# EasyEDA schematic SCH_Juzer_pedal_sch_2024-03-11.json
TITLE: Sheet_1; REV: 1.0; Date: 2023-09-30; Sheet: 1/1; Drawn By: juzer666; Company: Your Company
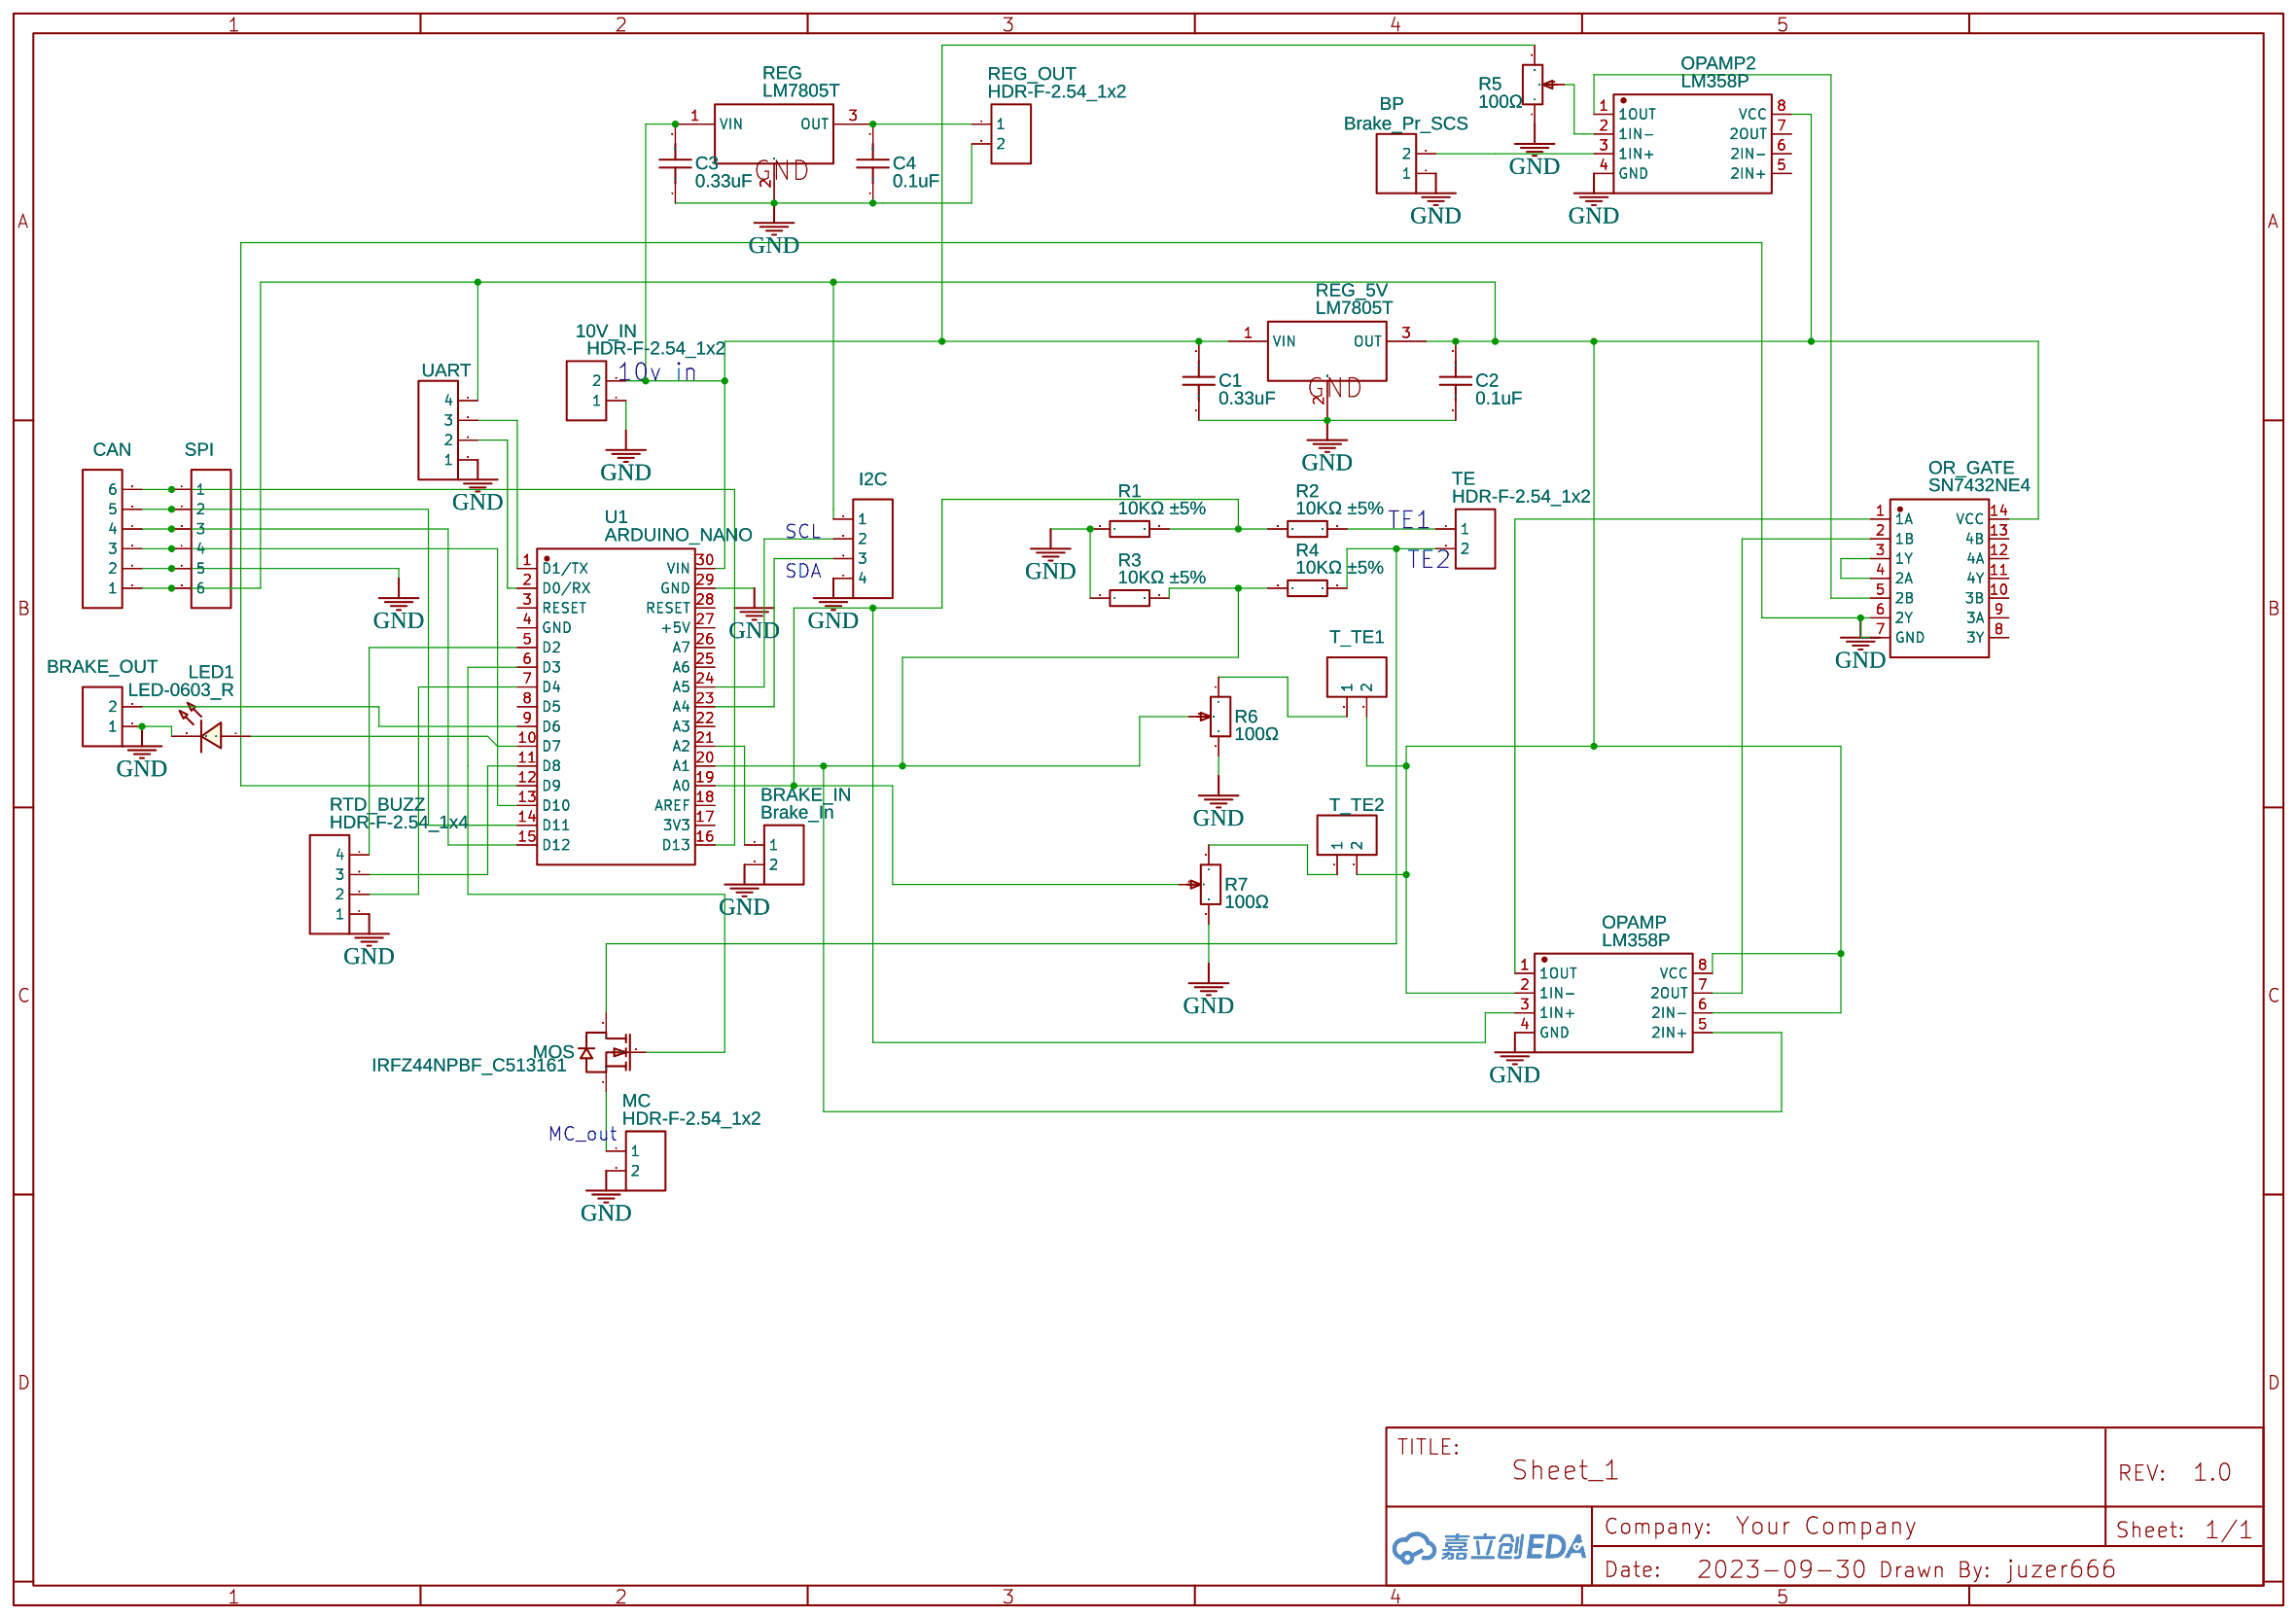
[diagram p0: schematic sheet]

## Parts
10V_IN  HDR-F-2.54_1x2  [CONN-TH_P5.00_KF126R-5.0-2P]
BP  Brake_Pr_SCS  [HDR-F-2.54_1X2]
BRAKE_IN  Brake_In  [CONN-TH_P5.00_KF126R-5.0-2P]
BRAKE_OUT  Brake_Out  [HDR-F-2.54_1X2]
C1  0.33uF  [C0603]
C2  0.1uF  [C0603]
C3  0.33uF  [C0603]
C4  0.1uF  [C0603]
CAN  CAN  [HDR-F-2.54_1X6]
I2C  I2C  [HDR-F-2.54_1X4]
LED1  LED-0603_R  [LED0603_RED]
MC  HDR-F-2.54_1x2  [CONN-TH_P5.00_KF126R-5.0-2P]
MOS  IRFZ44NPBF_C513161  [TO-220-3_L10.0-W4.5-P2.54-L]
OPAMP  LM358P  [DIP-8_L9.4-W6.4-P2.54-LS9.1-BL]
OPAMP2  LM358P  [DIP-8_L9.4-W6.4-P2.54-LS9.1-BL]
OR_GATE  SN7432NE4  [PDIP-14_L19.3-W6.4-P2.54-LS7.9-BL-1]
R1  10KΩ ±5%  [RESISTANCE 10K]
R2  10KΩ ±5%  [RESISTANCE 10K]
R3  10KΩ ±5%  [RESISTANCE 10K]
R4  10KΩ ±5%  [RESISTANCE 10K]
R5  100Ω  [RES-ADJ-TH_3296W]
R6  100Ω  [RES-ADJ-TH_3296W]
R7  100Ω  [RES-ADJ-TH_3296W]
REG  LM7805T  [TO-220-3_L10.0-W4.5-P2.54-L]
REG_5V  LM7805T  [TO-220-3_L10.0-W4.5-P2.54-L]
REG_OUT  HDR-F-2.54_1x2  [HDR-F-2.54_1X2]
RTD_BUZZ  HDR-F-2.54_1x4  [HDR-F-2.54_1X4]
SPI  SPI  [HDR-F-2.54_1X6]
T_TE1  TE1_Test  [HDR-F-2.54_1X2]
T_TE2  TE2_Test  [HDR-F-2.54_1X2]
TE  HDR-F-2.54_1x2  [CONN-TH_P5.00_KF126R-5.0-2P]
U1  ARDUINO_NANO  [COMM-TH_ARDUINO_NANO]
UART  UART  [HDR-F-2.54_1X4]

## Library data of the parts
10V_IN BP BRAKE_IN BRAKE_OUT MC REG_OUT T_TE1 T_TE2 TE = HDR-F-2.54_1x2: Supplier Part: C49661; Supplier: LCSC; Contributor: LCEDA_Lib
C1-C4 = 250V 0.1UF 5% CBBCapacitor: Supplier: LCSC; Manufacturer: ReliaPro; Supplier Part: C46804
CAN SPI = HDR-F-2.54_1x6: Supplier Part: C40877; Supplier: LCSC; Contributor: LCEDA_Lib
I2C RTD_BUZZ UART = HDR-F-2.54_1x4: Supplier Part: C225501; Supplier: LCSC; Contributor: LCEDA_Lib
LED1 = LED-0603_R: Manufacturer: EVERLIGHT(台湾亿光); Manufacturer Part: 19-217/R6C-AL1M2VY/3T; Supplier Part: C72044; Supplier: LCSC; Contributor: LCEDA_01
MOS = IRFZ44NPBF_C513161: Supplier: LCSC; Supplier Part: C513161; Manufacturer: null; Manufacturer Part: IRFZ44NPBF; Contributor: LCSC
OPAMP OPAMP2 = LM358P: Supplier: LCSC; Manufacturer: TI(德州仪器); Supplier Part: C5213; JLCPCB Part Class: Extended Part
OR_GATE = SN7432NE4: Contributor: lcsc; Supplier: LCSC; Supplier Part: C4471426; Manufacturer: TI(德州仪器)
R1-R4 = RESISTANCE_10K: Supplier: LCSC; Supplier Part: C123392; Manufacturer: Nanjing Shiheng Elec; Manufacturer Part: MF58 103J3470; Contributor: Evgeniy_ANP; JLCPCB Part Class: Extended Part
R5-R7 = 3296W-1-101LF: Supplier: LCSC; Manufacturer: BOURNS; Supplier Part: C83688; Resistance(Ohms): 100; Resistance (Ohms): 100; JLCPCB Part Class: Extended Part
REG REG_5V = LM7805T: Contributor: LCSC; Supplier: LCSC; Supplier Part: C507145; Manufacturer: HGC(华冠); JLCPCB Part Class: Extended Part
U1 = ARDUINO_NANO: Supplier: LCSC; Supplier Part: C9900017879; Manufacturer: null; JLCPCB Part Class: Extended Part; Contributor: lcsc

## Nets
GND: 10V_IN.1 BP.1 BRAKE_IN.2 BRAKE_OUT.1 C1.1 C2.1 C3.1 C4.1 CAN.2 I2C.4 LED1.2 MC.2 OPAMP.4(GND) OPAMP2.4(GND) OR_GATE.6(2Y) OR_GATE.7(GND) R1.1 R3.1 R5.1 R6.3 R7.3 REG.2(GND) REG_5V.2(GND) REG_OUT.2 RTD_BUZZ.1 SPI.5 U1.12(D9) U1.29(GND) UART.1
Net-(10V_IN-2): 10V_IN.2 C1.2 C3.2 R5.3 REG.1(VIN) REG_5V.1(VIN) U1.30(VIN)
Net-(BP-2): BP.2 OPAMP2.3(1IN+)
Net-(BRAKE_IN-1): BRAKE_IN.1 U1.21(A2)
Net-(BRAKE_OUT-2): BRAKE_OUT.2 U1.9(D6)
Net-(C2-2): C2.2 CAN.1 I2C.1 OPAMP.2(1IN-) OPAMP.6(2IN-) OPAMP.8(VCC) OPAMP2.8(VCC) OR_GATE.14(VCC) REG_5V.3(OUT) SPI.6 T_TE1.2 T_TE2.2 UART.4
Net-(C4-2): C4.2 REG.3(OUT) REG_OUT.1
Net-(CAN-3): CAN.3 SPI.4 U1.13(D10)
Net-(CAN-4): CAN.4 SPI.3 U1.15(D12)
Net-(CAN-5): CAN.5 SPI.2 U1.14(D11)
Net-(CAN-6): CAN.6 SPI.1 U1.16(D13)
Net-(I2C-2): I2C.2 U1.24(A5)
Net-(I2C-3): I2C.3 U1.23(A4)
Net-(LED1-1): LED1.1 U1.10(D7)
Net-(MC-1): MC.1 MOS.3(S)
Net-(MOS-1): MOS.1(G) U1.6(D3)
Net-(MOS-2): MOS.2(D) R4.2 TE.2
Net-(OPAMP2-1): OPAMP2.1(1OUT) OR_GATE.5(2B)
Net-(OPAMP2-2): OPAMP2.2(1IN-) R5.2
Net-(OPAMP-1): OPAMP.1(1OUT) OR_GATE.1(1A)
Net-(OPAMP-3): OPAMP.3(1IN+) R1.2 R2.1 R7.2 U1.19(A0)
Net-(OPAMP-5): OPAMP.5(2IN+) R3.2 R4.1 R6.2 U1.20(A1)
Net-(OPAMP-7): OPAMP.7(2OUT) OR_GATE.2(1B)
Net-(OR_GATE-3): OR_GATE.3(1Y) OR_GATE.4(2A)
Net-(R2-2): R2.2 TE.1
Net-(R6-1): R6.1 T_TE1.1
Net-(R7-1): R7.1 T_TE2.1
Net-(RTD_BUZZ-2): RTD_BUZZ.2 U1.7(D4)
Net-(RTD_BUZZ-3): RTD_BUZZ.3 U1.11(D8)
Net-(RTD_BUZZ-4): RTD_BUZZ.4 U1.5(D2)
Net-(U1-1): U1.1(D1/TX) UART.3
Net-(U1-2): U1.2(D0/RX) UART.2

Not connected (* = marked no-connect by the designer): OPAMP2 5(2IN+) 6(2IN-) 7(2OUT); OR_GATE 8(3Y) 9(3A) 10(3B) 11(4Y) 12(4A) 13(4B); U1 3(RESET) 4(GND) 8(D5) 17(3V3) 18(AREF) 22(A3) 25(A6) 26(A7) 27(+5V) 28(RESET)

## Notes on the sheet
- 10v in
- TE1
- SCL
- TE2
- SDA
- MC_out
